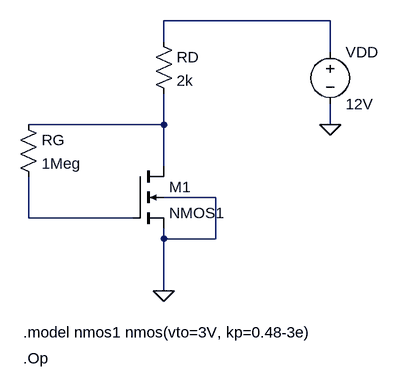
[diagram p0: schematic Sơ đồ phân cực cho ứng dụng E-MOSFET kiểu hồi phục tiếp theo.asc]
Sơ đồ phân cực cho ứng dụng E-MOSFET kiểu hồi phục tiếp theo.asc, the LTspice schematic file:
Version 4
SHEET 1 880 680
WIRE 448 -96 192 -96
WIRE 192 -64 192 -96
WIRE 448 -48 448 -96
WIRE 192 64 192 16
WIRE 192 64 -16 64
WIRE 448 64 448 32
WIRE 192 128 192 64
WIRE 272 176 192 176
WIRE -16 208 -16 144
WIRE 144 208 -16 208
WIRE 192 240 192 224
WIRE 272 240 272 176
WIRE 272 240 192 240
WIRE 192 320 192 240
FLAG 192 320 0
FLAG 448 64 0
SYMBOL nmos4 144 128 R0
SYMATTR InstName M1
SYMATTR Value NMOS1
SYMBOL voltage 448 -64 R0
WINDOW 123 0 0 Left 0
WINDOW 39 0 0 Left 0
SYMATTR InstName VDD
SYMATTR Value 12V
SYMBOL res 176 -80 R0
SYMATTR InstName RD
SYMATTR Value 2k
SYMBOL res -32 48 R0
SYMATTR InstName RG
SYMATTR Value 1Meg
TEXT -24 384 Left 2 !.model nmos1 nmos(vto=3V, kp=0.48-3e)
TEXT -24 424 Left 2 !.Op

The netlist it stands for:
* Sơ đồ phân cực cho ứng dụng E-MOSFET kiểu hồi phục tiếp theo.asc
M1 N002 N003 0 0 NMOS1
VDD N001 0 12V
RD N001 N002 2k
RG N002 N003 1Meg
.model NMOS NMOS
.model PMOS PMOS
.lib standard.mos
.model nmos1 nmos(vto=3V, kp=0.48-3e)
.Op
.backanno
.end